# Altium schematic sheet S3C_IOs3V3_LevelShiftingAndDarlingtonLEDsFP.SchDoc
size A4
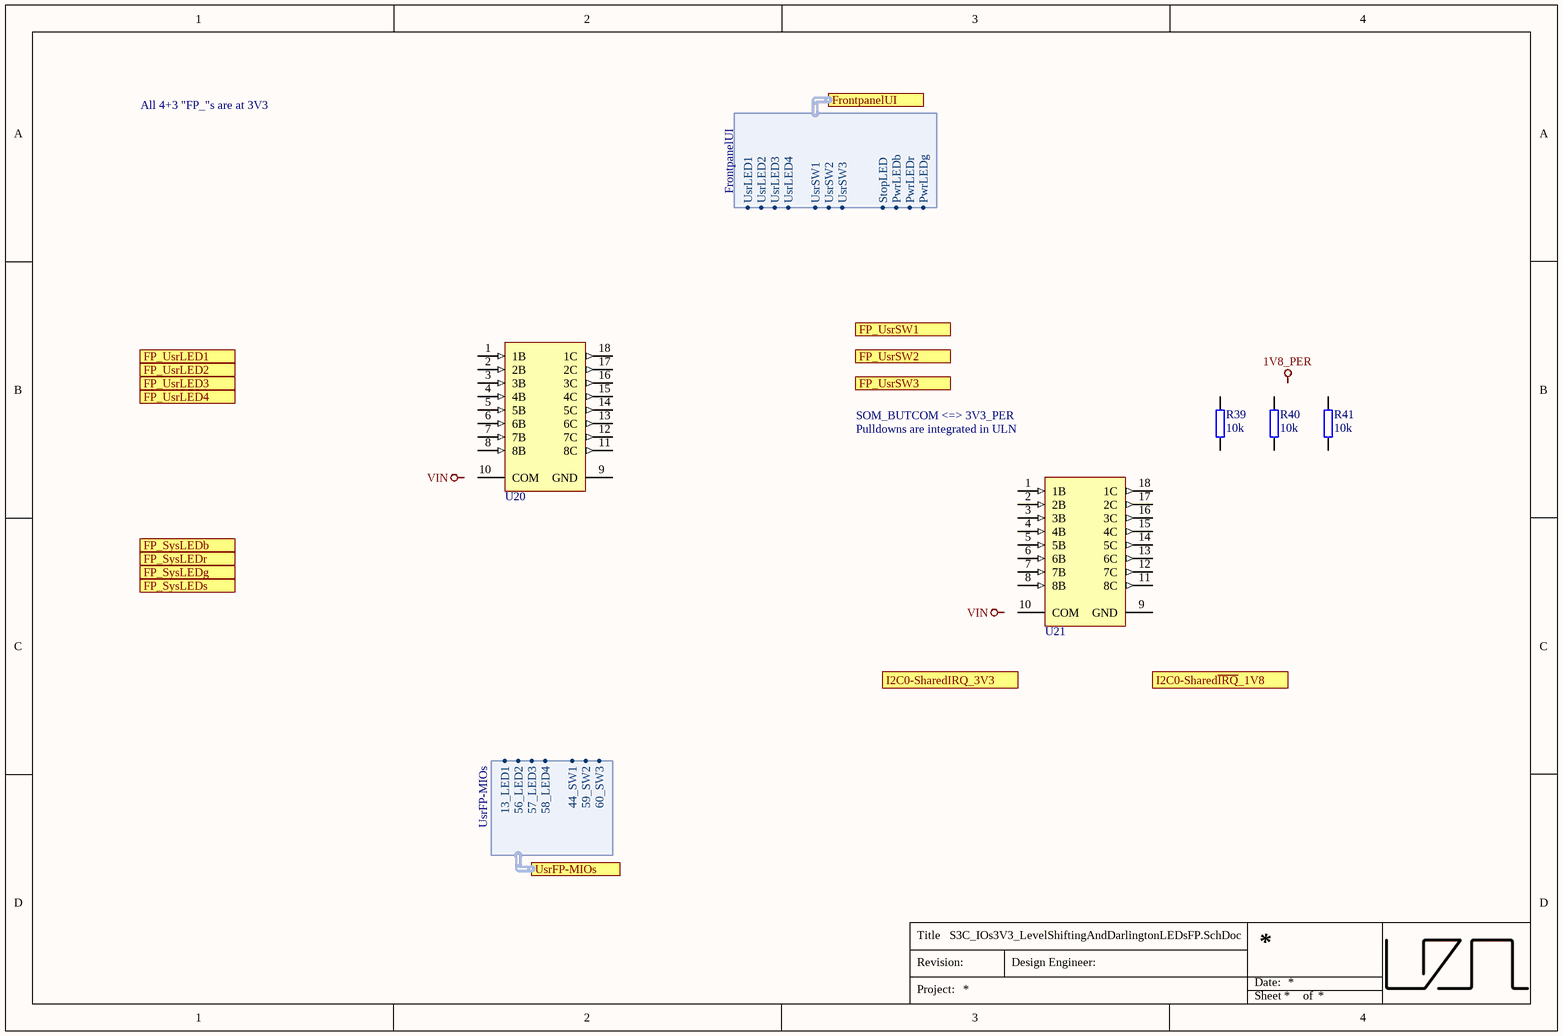
[diagram p0: S3C_IOs3V3_LevelShiftingAndDarlingtonLEDsFP.SchDoc]

## Parts
R39  10k  [R_0603_TE]
R40  10k  [R_0603_TE]
R41  10k  [R_0603_TE]
U20  ULN2803A  [FP-SOICW-18LD-PL-1-IPC_B]  (value not drawn)
U21  ULN2803A  [FP-SOICW-18LD-PL-1-IPC_B]  (value not drawn)

## Ports
FP_SysLEDb (in), FP_SysLEDg (in), FP_SysLEDr (in), FP_SysLEDs (in), FP_UsrLED1 (in), FP_UsrLED2 (in), FP_UsrLED3 (in), FP_UsrLED4 (in), FP_UsrSW1 (out), FP_UsrSW2 (out), FP_UsrSW3 (out), FrontpanelUI (harness FrontpanelUI), I2C0-SharedIRQ_3V3 (in), I2C0-Shared~{IRQ}_1V8 (out), UsrFP-MIOs (harness UsrFP-MIOs)

## Harnesses
UsrFP-MIOs: 13_LED1, 44_SW1, 56_LED2, 57_LED3, 58_LED4, 59_SW2, 60_SW3
FrontpanelUI: UsrLED1, UsrLED2, UsrLED3, UsrLED4, UsrSW1, UsrSW2, UsrSW3, StopLED, PwrLEDb, PwrLEDr, PwrLEDg

## Nets

Not connected (* = marked no-connect by the designer): R39 1 2; R40 1 2; R41 1 2; U20 1(1B) 2(2B) 3(3B) 4(4B) 5(5B) 6(6B) 7(7B) 8(8B) 9(GND) 10(COM) 11(8C) 12(7C) 13(6C) 14(5C) 15(4C) 16(3C) 17(2C) 18(1C); U21 1(1B) 2(2B) 3(3B) 4(4B) 5(5B) 6(6B) 7(7B) 8(8B) 9(GND) 10(COM) 11(8C) 12(7C) 13(6C) 14(5C) 15(4C) 16(3C) 17(2C) 18(1C)

## Notes on the sheet
- All 4+3 "FP_"s are at 3V3
- SOM_BUTCOM <=> 3V3_PER
- Pulldowns are integrated in ULN
- Labels drawn without touching a wire or pin: 1V8_PER, VIN
- Title
- Revision:
- Design Engineer:
- Date:
- Project:
- Sheet
- of

## Library data of the parts
R39-R41 = UZgen_R_0603_10k: Generic resistor; Manufacturer: UZgen; Tolerance: 1 %; Created from: AGeiger; Manufacturer Part Number: UZgen_R_0603_10k; PartID: 1; Created On: 02/07/2024 14:34:53; Value: 10k; Device Package: 0603; Mounting Type: SMD; Last Updated: 02/07/2024 14:37:16
U20 U21 = ULN2803A: Darlington Transistors Eight NPN Array; Manufacturer: UMW(Youtai Semiconductor Co., Ltd.); Created from: FRosner; Manufacturer Part Number: ULN2803A; PartID: 17; Created On: 13/06/2024 09:08:03; ComponentLink1Description: Datasheet; ComponentLink1URL: https://wmsc.lcsc.com/wmsc/upload/file/pdf/v2/lcsc/2311091738_UMW-Youtai-Semiconductor-Co---Ltd--ULN2803A_C845537.pdf; Component Type: Darlington Driver; Device Package: SOP-18; Last Updated: 04/09/2024 11:48:15; Mounting Type: SMT; Operating Temperature: -40~85 °C; Series: ULN2803A; Supplier 1: LCSC; Supplier Part Number 1: C845537; Type: Driver; Live Cycle Status: 1; LCSC Part Number: C845537